# Altium schematic sheet output.SchDoc: output
size A4; SheetNumber: 1; SheetTotal: 1
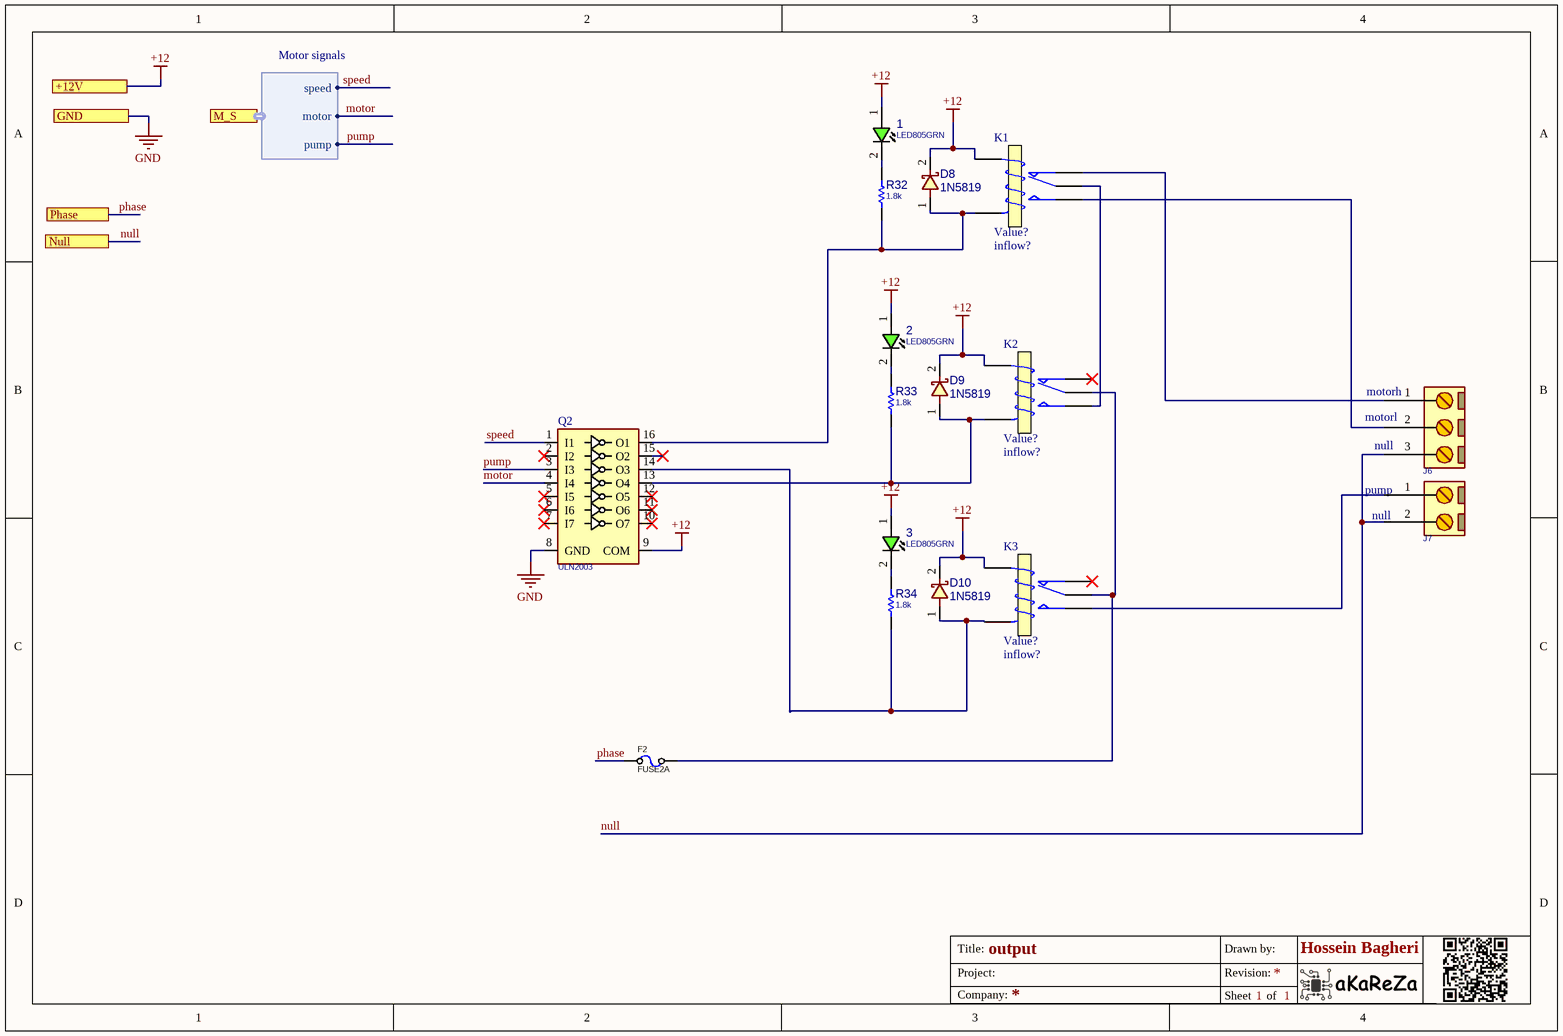
[diagram p0: output.SchDoc]

## Parts
1  LED805GRN  [LED0805GRN]
2  LED805GRN  [LED0805GRN]
3  LED805GRN  [LED0805GRN]
D8  1N5819  [D_SOD123W]
D9  1N5819  [D_SOD123W]
D10  1N5819  [D_SOD123W]
F2  FUSE2A  [FUSH_5X20MM]
J6  CONN_GMSTB3  [GMSTB762_3]  (value not drawn)
J7  CONN_GMSTB2  [GMSTB762_2]  (value not drawn)
K1  Inflow: inflow?  [Relay 15.40x12.10x13.10]  (hidden comment: Value?)
K2  Inflow: inflow?  [Relay 15.40x12.10x13.10]  (hidden comment: Value?)
K3  Inflow: inflow?  [Relay 15.40x12.10x13.10]  (hidden comment: Value?)
Q2  ULN2003  [SO_16_W]
R32  1.8k  [R0805]
R33  1.8k  [R0805]
R34  1.8k  [R0805]

## Ports
+12V, GND, M_S (harness Motor signals), Null, Phase

## Harnesses
Motor signals: speed, motor, pump

## Nets
+12: 1.1(ANODE) 2.1(ANODE) 3.1(ANODE) D8.2 D9.2 D10.2 K1.4(T1) K2.4(T1) K3.4(T1) Q2.9(COM) ; port +12V
GND: Q2.8(GND) ; port GND
motor: Q2.4(I4) ; port M_S.motor
null: J6.3 J7.2 ; port Null
phase: F2.1 ; port Phase
pump: Q2.3(I3) ; port M_S.pump
speed: Q2.1(I1) ; port M_S.speed
Net1_2: 1.2(CATHODE) R32.2
Net2_2: 2.2(CATHODE) R33.2
Net3_2: 3.2(CATHODE) R34.2
NetD8_1: D8.1 K1.5(T2) Q2.16(O1) R32.1
NetD9_1: D9.1 K2.5(T2) Q2.13(O4) R33.1
NetD10_1: D10.1 K3.5(T2) Q2.14(O3) R34.1
NetF2_2: F2.2 K2.1(COM) K3.1(COM)
NetJ6_1: J6.1 K1.2(NC)
NetJ6_2: J6.2 K1.3(NO)
NetJ7_1: J7.1 K3.3(NO)
NetK1_1: K1.1(COM) K2.3(NO)

Not connected (* = marked no-connect by the designer): K2 2(NC)*; K3 2(NC)*; Q2 2(I2)* 5(I5)* 6(I6)* 7(I7)* 10(O7)* 11(O6)* 12(O5)* 15(O2)*

## Notes on the sheet
- (near J6) motorl
- (near J6) motorh
- (near J6) null
- pump
- (near J7) null
- Title:
- Project:
- Drawn by:
- Revision:
- Hossein Bagheri
- Company:
- Sheet
- of

## Library data of the parts
1-3 = LED_SMD_0805_GRN: LED, SMD, 0805, GREEN; PARAM: 20mA; DESC: DESCRIPTION; PARAM2: 2.2V; MANF: -; ASSEMBLY: ASSEMBLY; PRICE: 36t@Javan; MANF_P#: -; VALUE: LED805GRN
D8-D10 = DIODE_SMD_SCHOTTKY_1N5819: DIODE, SCHOTTKY, 40V, 1A; MANF: DIODES; MANF_P#: 1N5819HW-7-F; DESC: DESCRIPTION; ASSEMBLY: ASSEMBLY; PRICE: PRICE; PARAM2: 1A; PARAM: 40V; VALUE: 1N5819
F2 = FUSE_5X20: Fuse HOLDER 5X20; PARAM: 2A; MANF_P#: MANF_PART#; MANF: MANF; PARAM2: PARAM2; VALUE: FUSE2A
J6 = CONN_GMSTB762_3: CONN, PHOENIX MSTB, 5-G, 5.08mm pitch; MANF_P#: GMSTB 2,5/3-G-7,62; VALUE: CONN_GMSTB3
J7 = CONN_GMSTB762_2: CONN, PHOENIX GMSTB, 7.62mm pitch; MANF_P#: GMSTB 2,5/2-G-7,62; VALUE: CONN_GMSTB2
K1-K3 = SW_Relay_SPDT: SPDT Relay; Rating: Rating?; Validation: Valid; Type: SPDT; Package: Dip; Value: Value?
Q2 = ULN2003_SOP16: Darlington, 7-CH, 50V, 0.5A; MANF_P#: ULN2003A; MANF: DIODES; PARAM: 7-CH, 50V, 0.5A; PARAM2: -; VALUE: ULN2003
R32-R34 = RES_SMD_0805: RESISTOR, SMD; PARAM: -W; DESC: DESCRIPTION; DIST#: MOUSER; PARAM2: 1%; MANF_P#: -; MANF: -; ASSEMBLY: ASSEMBLY; PRICE: 100= 0.5$; VALUE: 1.8k